# EAGLE schematic Power Supply No Slo Start-Carlos (EAGLE 7.1.0)
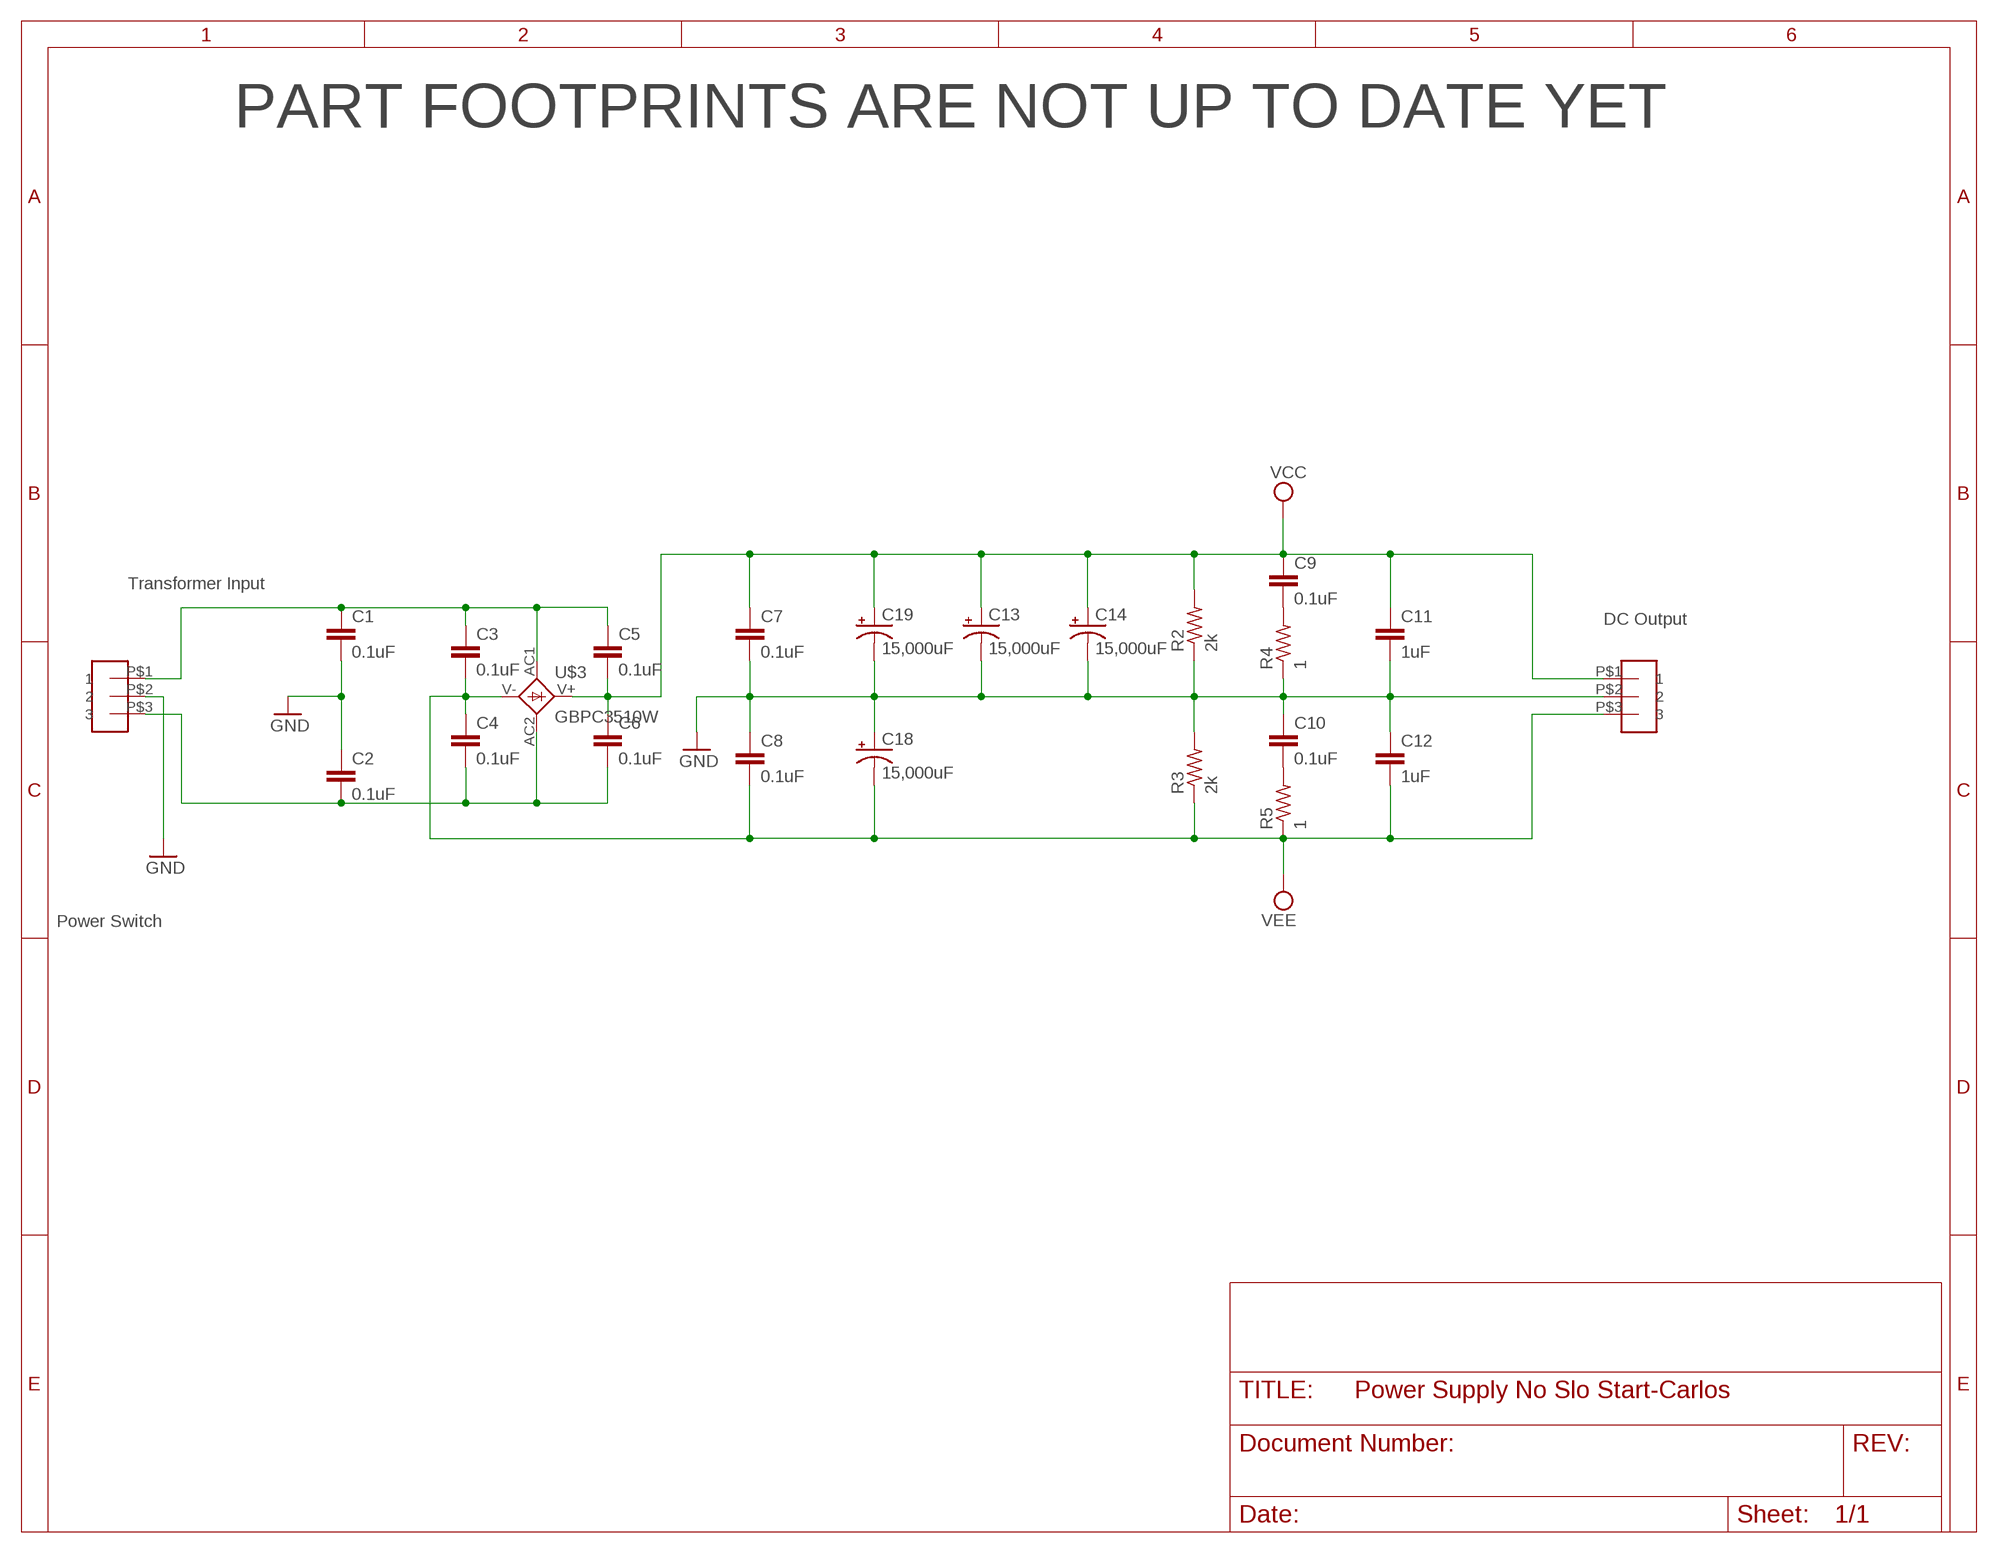
[diagram p0: schematic, sheet 1]

## Parts
C1  0.1uF  C-EU102-064X133  [C102-064X133]
C2  0.1uF  C-EU102-064X133  [C102-064X133]
C3  0.1uF  C-EU075-052X106  [C075-052X106]
C4  0.1uF  C-EU075-052X106  [C075-052X106]
C5  0.1uF  C-EU075-052X106  [C075-052X106]
C6  0.1uF  C-EU075-052X106  [C075-052X106]
C7  0.1uF  C-EU102-064X133  [C102-064X133]
C8  0.1uF  C-EU102-064X133  [C102-064X133]
C9  0.1uF  C-EU102-064X133  [C102-064X133]
C10  0.1uF  C-EU102-064X133  [C102-064X133]
C11  1uF  C-EU102-064X133  [C102-064X133]
C12  1uF  C-EU102-064X133  [C102-064X133]
C13  15,000uF  LNR1K153MSE  [PHI-35]
C14  15,000uF  LNR1K153MSE  [PHI-35]
C18  15,000uF  36X10222  [PHI-45]
C19  15,000uF  LNR1K153MSE  [PHI-35]
P1  3PIN_3.25MM  [3PIN_SCREW_EYELET]
P2  3PIN_3.25MM  [3PIN_SCREW_EYELET]
R2  2k  R-US_VTA52  [VTA52]
R3  2k  R-US_VTA52  [VTA52]
R4  1  R-US_0411/12  [0411/12]
R5  1  R-US_0411/12  [0411/12]
U$3  GBPC3510W  [GBPC3510W]

## Nets
AC1: C1.1 C3.1 C5.1 P1.P$1 U$3.AC1
AC2: C2.2 C4.2 C6.2 P1.P$3 U$3.AC2
GND: C1.2 C2.1 C7.2 C8.1 C10.1 C11.2 C12.1 C13.- C14.- C18.+ C19.- P1.P$2 P2.P$2 R2.1 R3.2 R4.1
N$1: C10.2 R5.2
N$2: C9.2 R4.2
VCC: C5.2 C6.1 C7.1 C9.1 C11.1 C13.+ C14.+ C19.+ P2.P$1 R2.2 U$3.V+(+)
VEE: C3.2 C4.1 C8.2 C12.2 C18.+1(-) P2.P$3 R3.1 R5.1 U$3.V-(-)

## Notes on the sheet
- PART FOOTPRINTS ARE NOT UP TO DATE YET
- Transformer Input
- DC Output
- Power Switch

## Library data of the parts
C1-C12 = rcl:C-EU: CAPACITOR, European symbol
C13 C14 C19 = Amplifier_Parts:LNR1K153MSE
C18 = Amplifier_Parts:36X10222
P1 P2 = Amplifier_Parts:3PIN_3.25MM
R2-R5 = rcl:R-US_: RESISTOR, American symbol
U$3 = Amplifier_Parts:GBPC3510W